# EAGLE design precharger_rev1 (EAGLE 8.6.0)
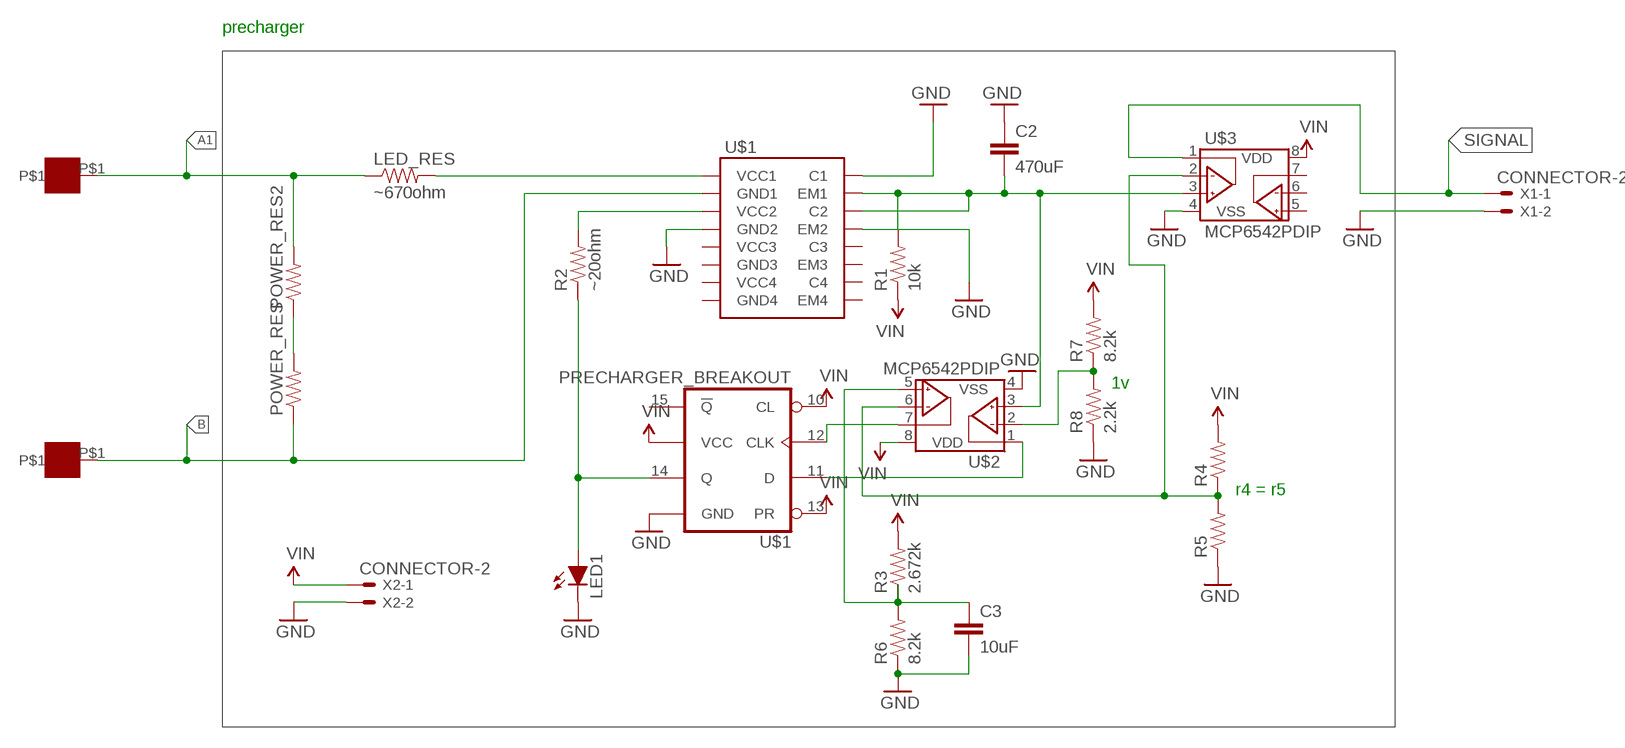
[diagram p0: schematic, sheet 1]

## Parts
+  SOLDER_PAD  [SOLDER_PAD_XSMALL]
-  SOLDER_PAD  [SOLDER_PAD_XSMALL]
C2  470uF  CAPPTH1  [CAP-PTH-5MM]
C3  10uF  CAPPTH1  [CAP-PTH-5MM]
LED1  LED-3MM  [LED-3MM]
LED_RES  ~670ohm  RESISTORAXIAL-0.3  [AXIAL-0.3]
POWER_RES  RESISTOR10W  [10W_RESISTOR_VISHAY]
POWER_RES2  RESISTOR10W  [10W_RESISTOR_VISHAY]
R1  10k  RESISTORAXIAL-0.3  [AXIAL-0.3]
R2  ~20ohm  RESISTORAXIAL-0.3  [AXIAL-0.3]
R3  2.672k  RESISTORAXIAL-0.3  [AXIAL-0.3]
R4  RESISTORAXIAL-0.3  [AXIAL-0.3]
R5  RESISTORAXIAL-0.3  [AXIAL-0.3]
R6  8.2k  RESISTORAXIAL-0.3  [AXIAL-0.3]
R7  8.2k  RESISTORAXIAL-0.3  [AXIAL-0.3]
R8  2.2k  RESISTORAXIAL-0.3  [AXIAL-0.3]
U$1  PRECHARGER_BREAKOUT  [PRECHARGER_BREAKOUT]
U$2  MCP6542PDIP  [DIL08]
U$3  MCP6542PDIP  [DIL08]
X1  CONNECTOR-2  [MINIFIT_5566-2]
X2  CONNECTOR-2  [MINIFIT_5566-2]

## Nets
A1: +.P$1 LED_RES.P$1 POWER_RES2.2
B: -.P$1 POWER_RES.1 U$1.2(GND1)
GND: C2.1 C3.2 LED1.K(C) R5.P$1 R6.P$1 R8.P$1 U$1.4(GND2) U$1.16(GND) U$1.29(EM2) U$1.32(C1) U$2.4(VSS) U$3.4(VSS) X1.2 X2.2
N$1: LED1.A R2.P$1 U$1.14(Q)
N$2: POWER_RES2.1 POWER_RES.2
N$3: C3.1 R3.P$1 R6.P$2 U$2.5(VINB+)
N$4: LED_RES.P$2 U$1.1(VCC1)
N$5: U$1.12(CLK) U$2.7(VOUTB)
N$6: U$1.11(D) U$2.1(VOUTA)
N$10: R4.P$1 R5.P$2 U$2.6(VINB-) U$3.2(VINA-)
N$11: R7.P$1 R8.P$2 U$2.2(VINA-)
N$12: R2.P$2 U$1.3(VCC2)
NODE: C2.2 R1.P$2 U$1.30(C2) U$1.31(EM1) U$2.3(VINA+) U$3.3(VINA+)
SIGNAL: U$3.1(VOUTA) X1.1
VIN: R1.P$1 R3.P$2 R4.P$2 R7.P$2 U$1.10(CL) U$1.13(PR) U$1.23(VCC) U$2.8(VDD) U$3.8(VDD) X2.1
Unconnected: U$1.5(VCC3) U$1.6(GND3) U$1.7(VCC4) U$1.8(GND4) U$1.15(!Q) U$1.25(EM4) U$1.26(C4) U$1.27(EM3) U$1.28(C3) U$3.5(VINB+) U$3.6(VINB-) U$3.7(VOUTB)

## Notes on the sheet
- precharger
- 1v
- r4 = r5

## Library data of the parts
+ - = HyTechDevices:SOLDER_PAD: Solder pad used to attach wires directly to PCB
C2 C3 = HyTechDevices:CAP: Capacitor Standard 0603 ceramic capacitor, and 0.1" leaded capacitor.
LED1 = HyTechDevices:LED: Light Emitting Diode (LED) Source: Dangerous Prototypes Eagle Library <https://github.com/DangerousPrototypes/Eagle_Part_Library>
LED_RES POWER_RES POWER_RES2 R1-R8 = HyTechDevices:RESISTOR: Resistor Basic schematic elements and footprints for 0603, 1206, and PTH resistors.
U$1 = HyTechDevices:PRECHARGER_BREAKOUT
U$2 U$3 = HyTechDevices:MCP6542: Microchip MCP6542 Dual Channel Push-Pull Comparator
X1 X2 = HyTechDevices:CONNECTOR-2: Mini-Fit Junior connector 2 pole Source: http://www.molex.com; OC_FARNELL: 1822072; OC_NEWARK: unknown

## Board
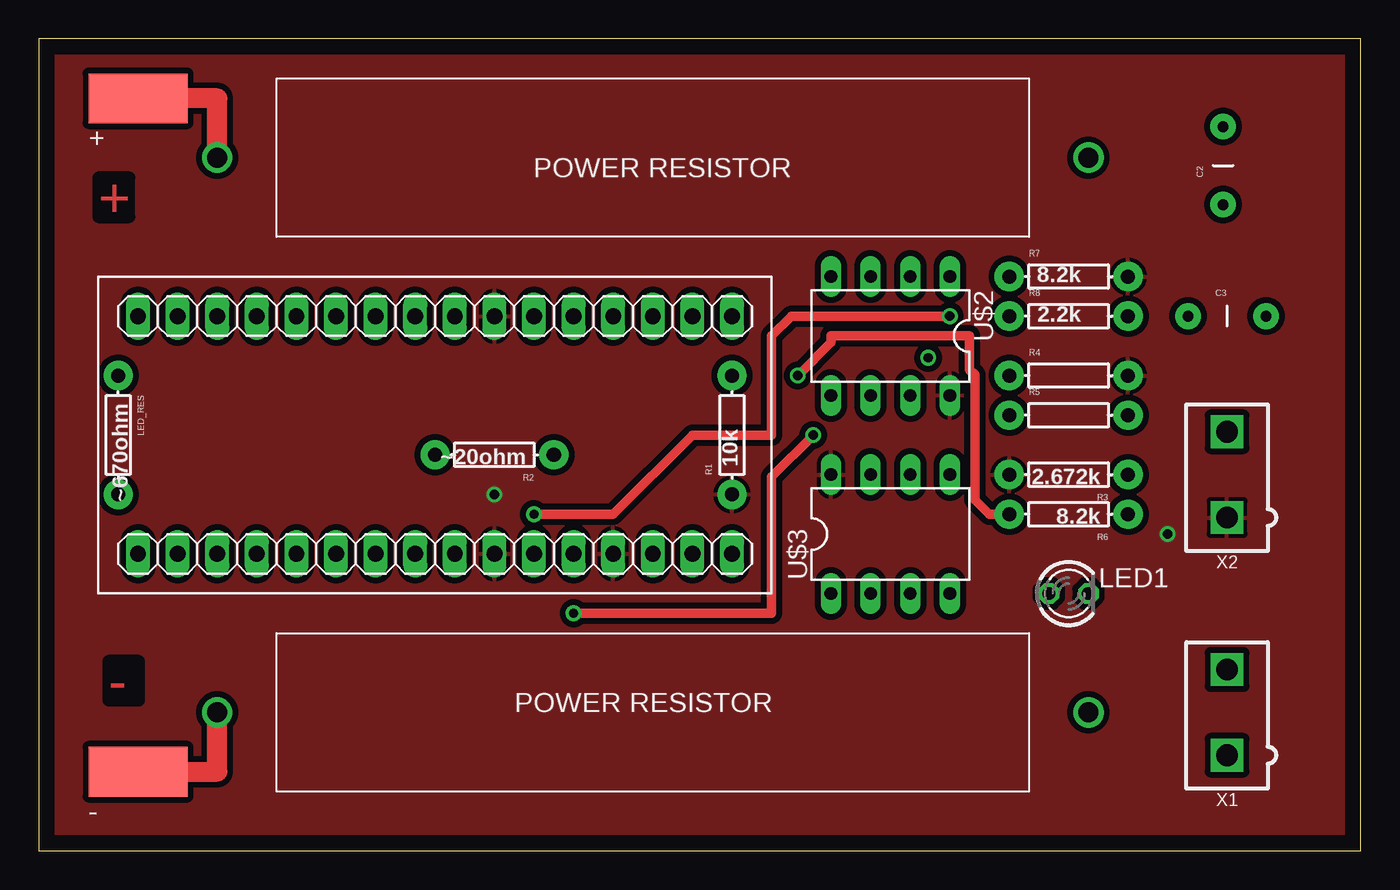
[diagram p1: board, top side]
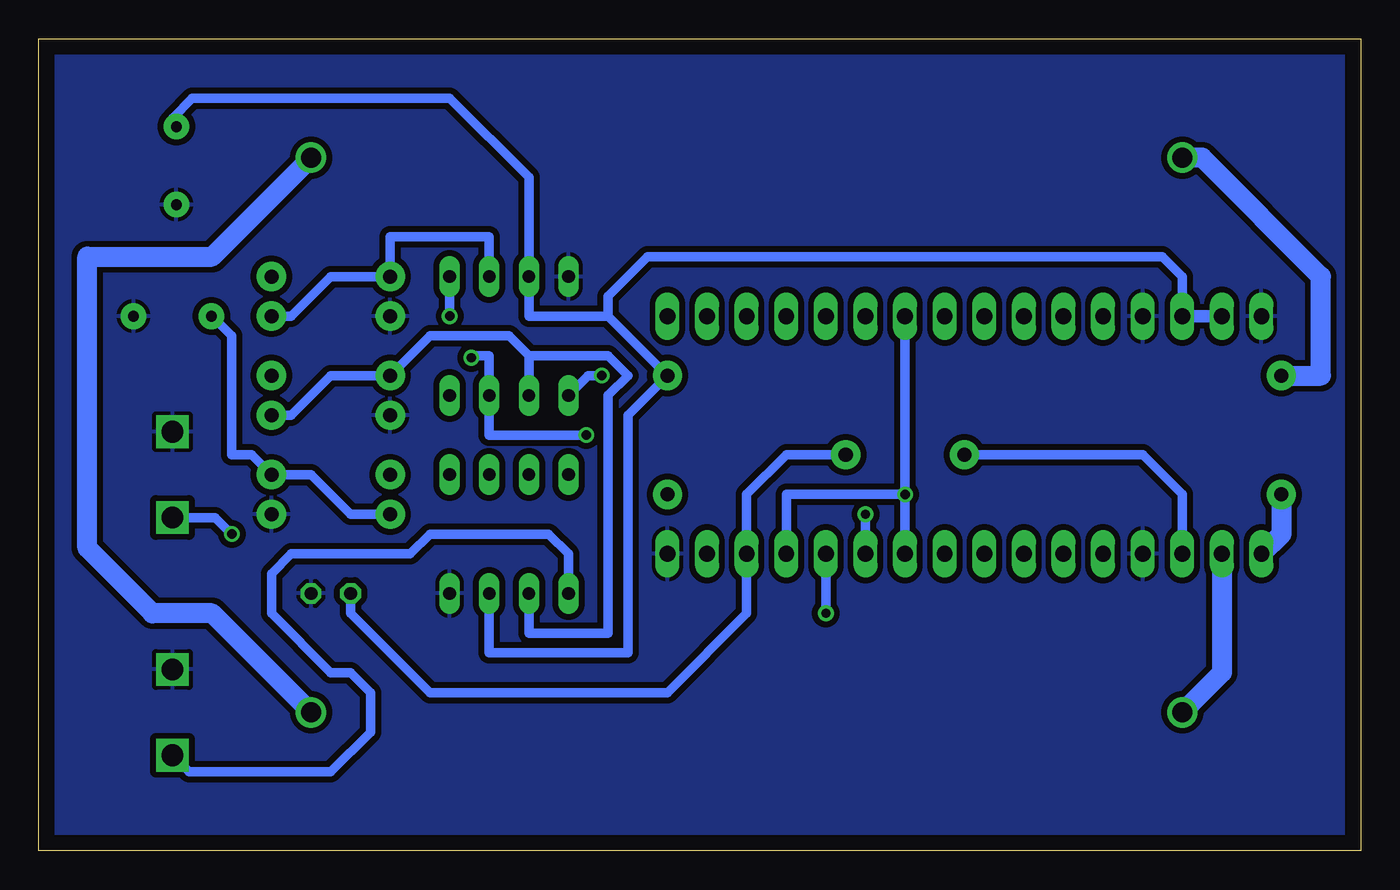
[diagram p2: board, bottom side, seen from below]

Size 84.76 x 52.06 mm. Coordinates in mm from the lower left corner, seen from the top.
Outline: 0,0 84.76,0 84.76,52.06 0,52.06 0,0
Copper layers (1*16): Top 0.035mm / dielectric 1.5mm / Bottom 0.035mm
Design rules "default *": minimum track width 6mil, minimum drill 0.35mm, track to track 15mil, track to pad 25mil, pad to pad 25mil, via to via 15mil, smd to smd 6mil, copper to edge 40mil, drill to drill 6mil, minimum pad ring 10mil, minimum via ring 8mil, stop-mask expansion 4mil, vias tented up to drill 0mil, thermal gap 10mil

### Footprints (pad centres in the part's own frame; a part is rotated, then mirrored left to right if it is on the bottom)
SOLDER_PAD_XSMALL = smd 6.35 x 3.175: P$1 0,0
CAP-PTH-5MM = drill 0.7 pad 1.651: 1 -2.5,0; 2 2.5,0
LED-3MM = drill 0.813 octagon: A -1.27,0; K 1.27,0
AXIAL-0.3 = drill 0.9 pad 1.88: P$1 -3.81,0; P$2 3.81,0
10W_RESISTOR_VISHAY = drill 1.3: 1 -3.81,0; 2 52.07,0
PRECHARGER_BREAKOUT = drill 1.016 long: 1 -7.62,15.24; 2 -7.62,12.7; 3 -7.62,10.16; 4 -7.62,7.62; 5 -7.62,5.08; 6 -7.62,2.54; 7 -7.62,0; 8 -7.62,-2.54; 9 -7.62,-5.08; 10 -7.62,-7.62; 11 -7.62,-10.16; 12 -7.62,-12.7; 13 -7.62,-15.24; 14 -7.62,-17.78; 15 -7.62,-20.32; 16 -7.62,-22.86; 17 7.62,-22.86; 18 7.62,-20.32; 19 7.62,-17.78; 20 7.62,-15.24; 21 7.62,-12.7; 22 7.62,-10.16; 23 7.62,-7.62; 24 7.62,-5.08; 25 7.62,-2.54; 26 7.62,0; 27 7.62,2.54; 28 7.62,5.08; 29 7.62,7.62; 30 7.62,10.16; 31 7.62,12.7; 32 7.62,15.24
DIL08 = drill 0.813 long: 1 -3.81,-3.81; 2 -1.27,-3.81; 3 1.27,-3.81; 4 3.81,-3.81; 5 3.81,3.81; 6 1.27,3.81; 7 -1.27,3.81; 8 -3.81,3.81
MINIFIT_5566-2 = drill 1.4 square: 1 0,-2.75; 2 0,2.75

### Placement (x,y rotation side)
+  6.35,48.26 0 top
-  6.35,5.08 0 top
C2  75.95,43.94 90 top
C3  76.2,34.29 0 top
LED1  66.04,16.51 0 top
LED_RES  5.08,26.67 270 top
POWER_RES  15.24,8.89 0 top
POWER_RES2  63.5,44.45 180 top
R1  44.45,26.67 90 top
R2  29.21,25.4 180 top
R3  66.04,24.13 180 top
R4  66.04,30.48 0 top
R5  66.04,27.94 0 top
R6  66.04,21.59 180 top
R7  66.04,36.83 0 top
R8  66.04,34.29 0 top
U$1  21.59,26.67 90 top
U$2  54.61,33.02 180 top
U$3  54.61,20.32 0 top
X1  76.2,8.89 0 top
X2  76.2,24.13 0 top

### Tracks (layer width: path | path; a pad name or v marks a point on that pad's centre or on a via)
A1
  Top 1.27: POWER_RES2.2 11.43,48.26 +.P$1
  Bottom 1.27: LED_RES.P$1 2.54,30.48 2.54,36.83 10.16,44.45 POWER_RES2.2
B
  Top 1.27: -.P$1 11.43,5.08 POWER_RES.1
  Bottom 1.27: U$1.2 8.89,11.43 POWER_RES.1
GND
  pour Bottom: 0,52.07 85.09,52.07 85.09,0 0,0
N$1
  Bottom 0.61: R2.P$1 36.83,25.4 39.37,22.86 U$1.14 39.37,15.24 44.45,10.16 59.69,10.16 64.77,15.24 LED1.A
N$2
  Bottom 1.27: POWER_RES.2 73.66,15.24 77.47,15.24 81.66,19.43 81.66,38.1 73.66,38.1 POWER_RES2.1
N$3  (via drill 0.6)
  Top 0.61: v48.67,30.48 50.8,32.61 50.8,33.02 59.69,33.02 59.69,30.86 60.02,30.53 60.02,25.45 60.02,25.4 60.02,22.53 60.96,21.59 R6.P$2
  Bottom 0.61: C3.1 73.66,34.29 72.39,33.02 72.39,25.4 71.12,25.4 R3.P$1 67.31,24.13 64.77,21.59 R6.P$2 | U$2.5 49.53,30.48 v48.67,30.48
N$4
  Bottom 1.27: LED_RES.P$2 5.08,20.32 U$1.1
N$5  (via drill 0.6)
  Top 0.61: v34.29,15.24 46.99,15.24 46.99,24 v49.66,26.67
  Bottom 0.61: v57.02,31.62 56.9,31.75 55.88,31.75 U$2.7 55.88,26.67 v49.66,26.67 | v34.29,15.24 U$1.12
N$6  (via drill 0.6)
  Top 0.61: v31.75,21.59 36.83,21.59 41.91,26.67 46.99,26.67 46.99,33.02 48.26,34.29 v58.42,34.29
  Bottom 0.61: U$1.11 v31.75,21.59 | v58.42,34.29 U$2.1
N$10
  Bottom 0.61: R5.P$2 68.58,27.94 66.04,30.48 R4.P$1 59.69,33.02 54.61,33.02 53.34,31.75 | 53.34,31.75 48.26,31.75 46.99,30.48 48.26,29.21 48.26,13.97 53.34,13.97 U$3.2 | 53.34,31.75 U$2.6
N$11
  Bottom 0.61: U$2.2 55.88,39.37 62.23,39.37 R7.P$1 66.04,36.83 68.58,34.29 R8.P$2
N$12
  Bottom 0.61: U$1.3 11.43,22.86 13.97,25.4 R2.P$2
NODE
  Bottom 0.61: 48.26,34.29 R1.P$2 46.99,27.94 46.99,12.7 55.88,12.7 U$3.3 | 48.26,34.29 53.34,34.29 U$2.3 53.34,43.18 58.42,48.26 74.93,48.26 76.2,46.99 76.2,46.7 C2.2 | 48.26,34.29 48.26,35.56 45.72,38.1 12.7,38.1 11.43,36.83 U$1.30
  Bottom 0.813: U$1.31 U$1.30
SIGNAL
  Bottom 0.61: U$3.1 50.8,19.05 52.07,20.32 59.69,20.32 60.96,19.05 68.58,19.05 69.85,17.78 69.85,15.24 66.04,11.43 64.77,11.43 63.5,10.16 63.5,7.62 66.04,5.08 75.14,5.08 X1.1
VIN  (via drill 0.6)
  Bottom 0.61: U$1.10 v29.21,22.86 | v29.21,22.86 U$1.23 | U$1.13 36.83,22.86 v29.21,22.86 | X2.1 73.45,21.38 v72.39,20.32
  pour Top: 0,52.07 85.09,52.07 85.09,0 0,0

### Text on the board
Top: + | -
tDocu: + | -